# EAGLE design BMFlexFuel V1.2 (EAGLE 8.6.0)
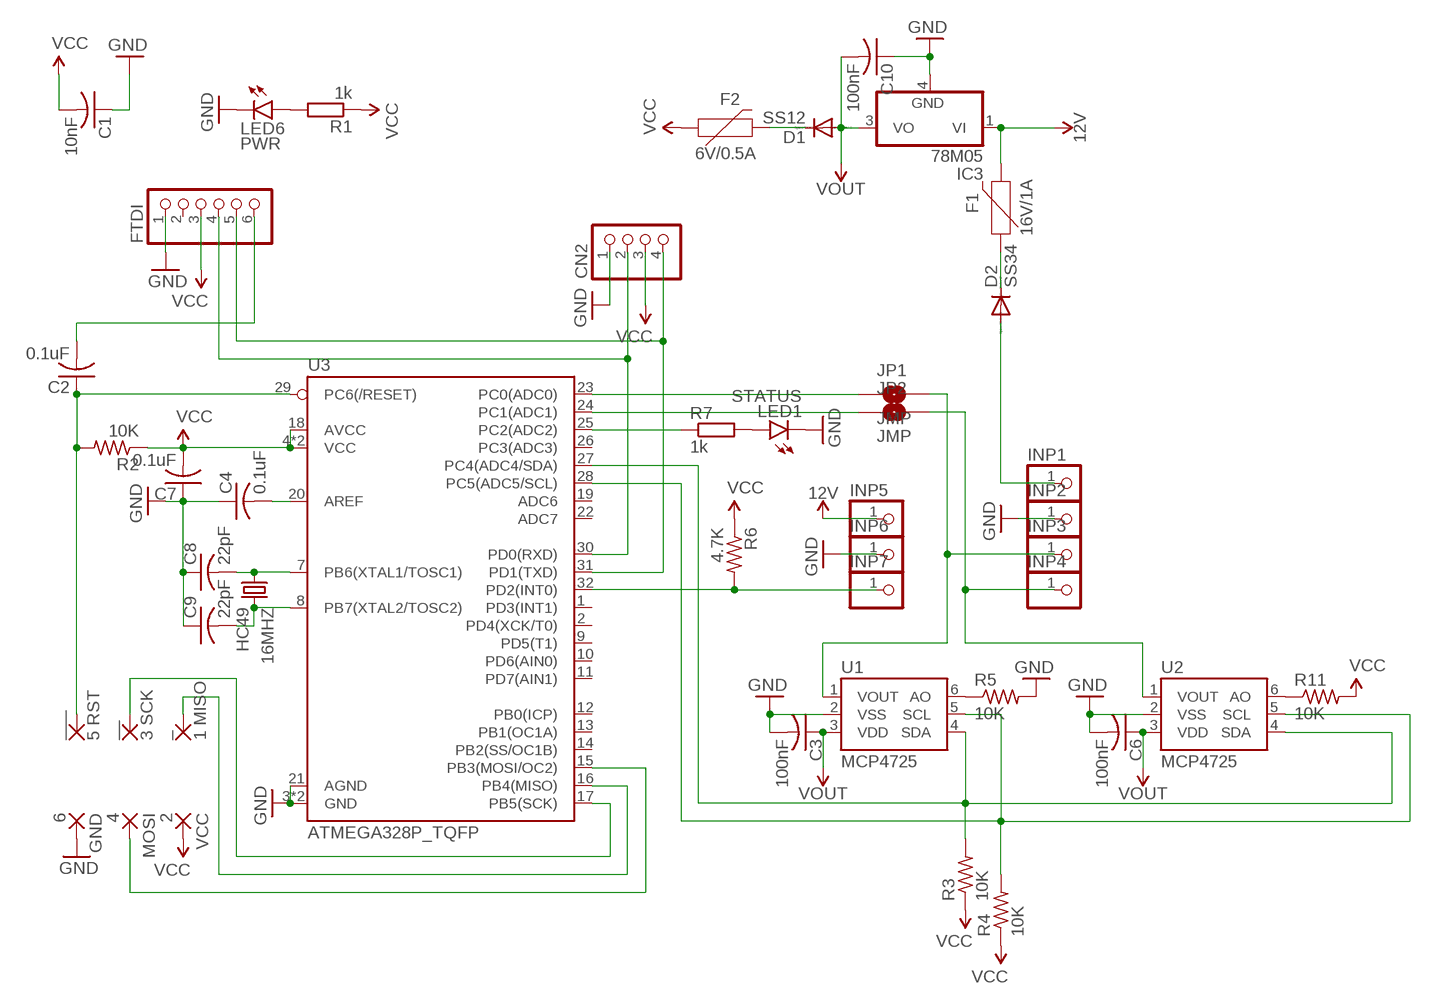
[diagram p0: schematic, sheet 1]

## Parts
16MHZ  HC49  CRYSTALS-NOGND-HC49  [HC49]
_  1 MISO  SMD2  [SMD1,27-2,54]
__  3 SCK  SMD2  [SMD1,27-2,54]
___  5 RST  SMD2  [SMD1,27-2,54]
C1  10nF  C-USC1206  [C1206]
C2  0.1uF  C-USC0603  [C0603]
C3  100nF  C-USC0603  [C0603]
C4  0.1uF  C-USC0603  [C0603]
C6  100nF  C-USC0603  [C0603]
C7  0.1uF  C-USC0603  [C0603]
C8  22pF  C-USC0603  [C0603]
C9  22pF  C-USC0603  [C0603]
C10  100nF  C-USC0603  [C0603]
CN2  PINHD-1X4  [1X04]
D1  SS12  DIODE-DO214AC  [DO214AC]
D2  SS34  DIODE-DO214AC  [DO214AC]
F1  16V/1A  PPTC_HALF-AMP  [1206]
F2  6V/0.5A  PPTC_HALF-AMP  [1206]
FTDI  PINHD-1X6  [1X06]
GND  6  SMD2  [SMD1,27-2,54]
IC3  78M05  MC78M05ABDT  [DPACK_3]
INP1  PINHD-1X1_LARGE  [1X01_LARGE]
INP2  PINHD-1X1_LARGE  [1X01_LARGE]
INP3  PINHD-1X1_LARGE  [1X01_LARGE]
INP4  PINHD-1X1_LARGE  [1X01_LARGE]
INP5  PINHD-1X1_LARGE  [1X01_LARGE]
INP6  PINHD-1X1_LARGE  [1X01_LARGE]
INP7  PINHD-1X1_LARGE  [1X01_LARGE]
JP1  JMP  JUMPER-SMT_2_NO_NO-SILK  [SMT-JUMPER_2_NO_NO-SILK]
JP2  JMP  JUMPER-SMT_2_NO_NO-SILK  [SMT-JUMPER_2_NO_NO-SILK]
LED1  STATUS  LEDCHIPLED_0805  [CHIPLED_0805]
LED6  PWR  LEDCHIPLED_0805  [CHIPLED_0805]
MOSI  4  SMD2  [SMD1,27-2,54]
R1  1k  R-EU_R0603  [R0603]
R2  10K  R-US_R0603  [R0603@1]
R3  10K  R-US_R0603  [R0603@1]
R4  10K  R-US_R0603  [R0603@1]
R5  10K  R-US_R0603  [R0603@1]
R6  4.7K  R-US_R0603  [R0603@1]
R7  1k  R-EU_R0603  [R0603]
R11  10K  R-US_R0603  [R0603@1]
U1  MCP4725  MCP4725SOT-23  [SOT23-6]
U2  MCP4725  MCP4725SOT-23  [SOT23-6]
U3  ATMEGA328P_TQFP  [TQFP32-08]
VCC  2  SMD2  [SMD1,27-2,54]

## Nets
12V: F1.2 IC3.1(VI) INP5.1
GND: C1.1 C3.2 C4.1 C6.2 C7.1 C8.1 C9.1 C10.1 CN2.1 FTDI.1 GND.1(P) IC3.4(GND) INP2.1 INP6.1 LED1.C LED6.C R5.2 U1.2(VSS) U2.2(VSS) U3.3(GND) U3.5(GND) U3.21(AGND)
N$1: INP7.1 R6.2 U3.32(PD2(INT0))
N$2: D2.C F1.1
N$3: JP1.1 U3.23(PC0(ADC0))
N$4: R3.2 U1.4(SDA) U2.4(SDA) U3.27(PC4(ADC4/SDA))
N$5: LED6.A R1.2
N$6: D1.C F2.2
N$7: JP2.1 U3.24(PC1(ADC1))
N$8: LED1.A R7.2
N$9: R7.1 U3.25(PC2(ADC2))
N$10: R5.1 U1.6(AO)
N$11: R11.1 U2.6(AO)
N$13: ___.1(P) C2.1 R2.2 U3.29(PC6(/RESET))
N$15: D2.A INP1.1
N$17: C4.2 U3.20(AREF)
N$18: 16MHZ.1 C8.2 U3.7(PB6(XTAL1/TOSC1))
N$19: INP3.1 JP1.2 U1.1(VOUT)
N$20: C2.2 FTDI.6
N$21: INP4.1 JP2.2 U2.1(VOUT)
N$22: R4.2 U1.5(SCL) U2.5(SCL) U3.28(PC5(ADC5/SCL))
N$23: 16MHZ.2 C9.2 U3.8(PB7(XTAL2/TOSC2))
N$27: CN2.2 FTDI.4 U3.30(PD0(RXD))
N$28: CN2.4 FTDI.5 U3.31(PD1(TXD))
N$30: __.1(P) U3.17(PB5(SCK))
N$31: _.1(P) U3.16(PB4(MISO))
N$33: MOSI.1(P) U3.15(PB3(MOSI/OC2))
VCC: C1.2 C7.2 CN2.3 F2.1 FTDI.3 R1.1 R2.1 R3.1 R4.1 R6.1 R11.2 U3.4(VCC) U3.6(VCC) U3.18(AVCC) VCC.1(P)
VOUT: C3.1 C6.1 C10.2 D1.A IC3.3(VO) U1.3(VDD) U2.3(VDD)
Unconnected: FTDI.2 U3.1(PD3(INT1)) U3.2(PD4(XCK/T0)) U3.9(PD5(T1)) U3.10(PD6(AIN0)) U3.11(PD7(AIN1)) U3.12(PB0(ICP)) U3.13(PB1(OC1A)) U3.14(PB2(SS/OC1B)) U3.19(ADC6) U3.22(ADC7) U3.26(PC3(ADC3))

## Library data of the parts
16MHZ = IQD-Frequency-Products:CRYSTALS-NOGND: CRYSTALS CAN NOT GROUNDED
_ __ ___ GND MOSI VCC = wirepad:SMD2: SMD PAD
C1-C4 C6-C10 = resistor:C-US: CAPACITOR, American symbol
CN2 = pinhead_MOD:PINHD-1X4: PIN HEADER
D1 D2 = diode:DIODE-: DIODE
F1 = SparkFun-Fuses:PPTC: Resettable Fuse PPTC Resettable Fuse. Really a sort of resistor with a polymeric positive temperature coefficient whose resistance increases dramatically with an increase in temperature. When heated by the power passing through the resistance rises causing the current to be limited, protecting the circuit. This is achieved by the transition of the polymer from a crystalline to an amorphous state where the conductive carbon separates breaking the conductive pathways found in the cool crystalline structure. When a PPTC cools back down it resumes conducting letting the circuit turn back on. SparkFun Products: SparkFun RedBoard - Programmed with Arduino <https://www.sparkfun.com/products/12757> Pro Micro - 5V/16MHz <https://www.sparkfun.com/products/12640> Arduino Pro 328 - 5V/16MHz <https://www.sparkfun.com/products/10915> MP3 Trigger <https://www.sparkfun.com/products/13720>; PROD_ID: RES-08585; VALUE: 6V/0.5A
F2 = SparkFun-Fuses:PPTC: Resettable Fuse PPTC Resettable Fuse. Really a sort of resistor with a polymeric positive temperature coefficient whose resistance increases dramatically with an increase in temperature. When heated by the power passing through the resistance rises causing the current to be limited, protecting the circuit. This is achieved by the transition of the polymer from a crystalline to an amorphous state where the conductive carbon separates breaking the conductive pathways found in the cool crystalline structure. When a PPTC cools back down it resumes conducting letting the circuit turn back on. SparkFun Products: SparkFun RedBoard - Programmed with Arduino <https://www.sparkfun.com/products/12757> Pro Micro - 5V/16MHz <https://www.sparkfun.com/products/12640> Arduino Pro 328 - 5V/16MHz <https://www.sparkfun.com/products/10915> MP3 Trigger <https://www.sparkfun.com/products/13720>; PROD_ID: RES-08585
FTDI = pinhead_MOD:PINHD-1X6: PIN HEADER
IC3 = linear:MC78M: 500 mA Positive Voltage Regulators Source: Data sheet <http://www.onsemi.com/pub_link/Collateral/MC78M00-D.PDF>
INP1-INP7 = pinhead_MOD:PINHD-1X1_LARGE: PIN HEADER
JP1 JP2 = SparkFun-Jumpers:JUMPER-SMT_2_NO: Normally open jumper This jumper has two pads in close proximity to each other. Apply solder to close the connection. Round pads are easier to solder for beginners, but are a lot larger. SparkFun Product that uses the round pads: SparkFun EL Sequencer <https://www.sparkfun.com/products/12781>
LED1 LED6 = led:LED: LED OSRAM: - CHIPLED LG R971, LG N971, LY N971, LG Q971, LY Q971, LO R971, LY R971 LH N974, LH R974 LS Q976, LO Q976, LY Q976 LO Q996 - Hyper CHIPLED LW Q18S LB Q993, LB Q99A, LB R99A - SideLED LS A670, LO A670, LY A670, LG A670, LP A670 LB A673, LV A673, LT A673, LW A673 LH A674 LY A675 LS A676, LA A676, LO A676, LY A676, LW A676 LS A679, LY A679, LG A679 - Hyper Micro SIDELED® LS Y876, LA Y876, LO Y876, LY Y876 LT Y87S - SmartLED LW L88C, LW L88S LB L89C, LB L89S, LG L890 LS L89K, LO L89K, LY L89K LS L896, LA L896, LO L896, LY L896 - TOPLED LS T670, LO T670, LY T670, LG T670, LP T670 LSG T670, LSP T670, LSY T670, LOP T670, LYG T670 LG T671, LOG T671, LSG T671 LB T673, LV T673, LT T673, LW T673 LH T674 LS T676, LA T676, LO T676, LY T676, LB T676, LH T676, LSB T676, LW T676 LB T67C, LV T67C, LT T67C, LS T67K, LO T67K, LY T67K, LW E67C LS E67B, LA E67B, LO E67B, LY E67B, LB E67C, LV E67C, LT E67C LW T67C LS T679, LY T679, LG T679 LS T770, LO T770, LY T770, LG T770, LP T770 LB T773, LV T773, LT T773, LW T773 LH T774 LS E675, LA E675, LY E675, LS T675 LS T776, LA T776, LO T776, LY T776, LB T776 LHGB T686 LT T68C, LB T68C - Hyper Mini TOPLED® LB M676 - Mini TOPLED Santana® LG M470 LS M47K, LO M47K, LY M47K Source: http://www.osram.convergy.de LUXEON: - LUMILED® LXK2-PW12-R00, LXK2-PW12-S00, LXK2-PW14-U00, LXK2-PW14-V00 LXK2-PM12-R00, LXK2-PM12-S00, LXK2-PM14-U00 LXK2-PE12-Q00, LXK2-PE12-R00, LXK2-PE12-S00, LXK2-PE14-T00, LXK2-PE14-U00 LXK2-PB12-K00, LXK2-PB12-L00, LXK2-PB12-M00, LXK2-PB14-N00, LXK2-PB14-P00, LXK2-PB14-Q00 LXK2-PR12-L00, LXK2-PR12-M00, LXK2-PR14-Q00, LXK2-PR14-R00 LXK2-PD12-Q00, LXK2-PD12-R00, LXK2-PD12-S00 LXK2-PH12-R00, LXK2-PH12-S00 LXK2-PL12-P00, LXK2-PL12-Q00, LXK2-PL12-R00 Source: www.luxeon.com KINGBRIGHT: KA-3528ASYC Source: www.kingbright.com
R1 R7 = resistor:R-EU_: RESISTOR, European symbol
R2-R6 R11 = resistor:R-US_: RESISTOR, American symbol
U1 U2 = SparkFun-IC-Conversion:MCP4725: MCP4725 DAC Microchip 12-bit I2C DAC, SOT23-6 Datasheet <https://cdn.sparkfun.com/datasheets/BreakoutBoards/MCP4725_2009.pdf> SparkFun Products SparkFun I2C DAC Breakout - MCP4725 <https://www.sparkfun.com/products/12918> (BOB-12918); PROD_ID: IC-08886
U3 = SparkFun-IC-Microcontroller:ATMEGA328P_TQFP: Popular 328P in QFP Storefront component: ATmega328 - TQFP <https://www.sparkfun.com/products/13448> (COM-13448) Datasheet <http://www.sparkfun.com/datasheets/Components/SMD/ATMega328.pdf> SparkFun Products SparkFun RedBoard - Programmed with Arduino <https://www.sparkfun.com/products/12757> (DEV-12757) Arduino Pro Mini 328 - 5V/16MHz <https://www.sparkfun.com/products/11113> (DEV-11113) Arduino Pro Mini 328 - 3.3V/8MHz <https://www.sparkfun.com/products/11114> (DEV-11114) SparkFun OpenLog <https://www.sparkfun.com/products/13712> (DEV-13712) SparkFun MicroView - OLED Arduino Module <https://www.sparkfun.com/products/12923> (DEV-12923) SparkFun Digital Sandbox <https://www.sparkfun.com/products/12651> (DEV-12651) SparkFun PicoBoard <https://www.sparkfun.com/products/11888> (WIG-11888) Arduino Fio <https://www.sparkfun.com/products/10116> (DEV-10116) LilyPad Arduino 328 Main Board <https://www.sparkfun.com/products/13342> (DEV-13342) SparkFun RedStick <https://www.sparkfun.com/products/13741> (DEV-13741) LilyPad MP3 <https://www.sparkfun.com/products/11013> (DEV-11013) LilyPad Arduino SimpleSnap <https://www.sparkfun.com/products/10941> (DEV-10941) SparkFun Stepoko <https://www.sparkfun.com/products/13899> (ROB-13899) SparkFun Geiger Counter <https://www.sparkfun.com/products/11345> (SEN-11345) SparkFun EL Sequencer <https://www.sparkfun.com/products/12781> (COM-12781) Arduino Pro 328 - 5V/16MHz <https://www.sparkfun.com/products/10915> (DEV-10915) CryptoCape <https://www.sparkfun.com/products/12773> (DEV-12773) SparkFun IR Thermometer Evaluation Board - MLX90614 <https://www.sparkfun.com/products/10740> (SEN-10740) SparkFun RedBot Mainboard <https://www.sparkfun.com/products/12097> (ROB-12097) Arduino Pro 328 - 3.3V/8MHz <https://www.sparkfun.com/products/10914> (DEV-10914) SparkFun Block for Intel® Edison - Arduino <https://www.sparkfun.com/products/13036> (DEV-13036) SparkFun Simon Says - Surface Mount Soldering Kit <https://www.sparkfun.com/products/10935> (KIT-10935) SparkFun 7-Segment Serial Display - Red <https://www.sparkfun.com/products/11441> (COM-11441) SparkFun 7-Segment Serial Display - White <https://www.sparkfun.com/products/11629> (COM-11629) SparkFun 7-Segment Serial Display - Yellow <https://www.sparkfun.com/products/11443> (COM-11443) SparkFun 7-Segment Serial Display - Kelly Green <https://www.sparkfun.com/products/11440> (COM-11440) SparkFun 7-Segment Serial Display - Blue <https://www.sparkfun.com/products/11442> (COM-11442) SparkFun OpenSegment Serial Display - 20mm (Blue) <https://www.sparkfun.com/products/11647> (COM-11647) SparkFun OpenSegment Serial Display - 20mm (Green) <https://www.sparkfun.com/products/11646> (COM-11646) SparkFun OpenSegment Serial Display - 20mm (White) <https://www.sparkfun.com/products/11648> (COM-11648) SparkFun OpenSegment Serial Display - 20mm (Red) <https://www.sparkfun.com/products/11644> (COM-11644) SparkFun OpenSegment Serial Display - 20mm (Yellow) <https://www.sparkfun.com/products/11645> (COM-11645) SparkFun OpenSegment Shield <https://www.sparkfun.com/products/13190> (DEV-13190); PROD_ID: IC-09069

## Net classes
3 usbvcc: width 0.508 mm, drill 0.61 mm, clearance 0.254 mm

## Board
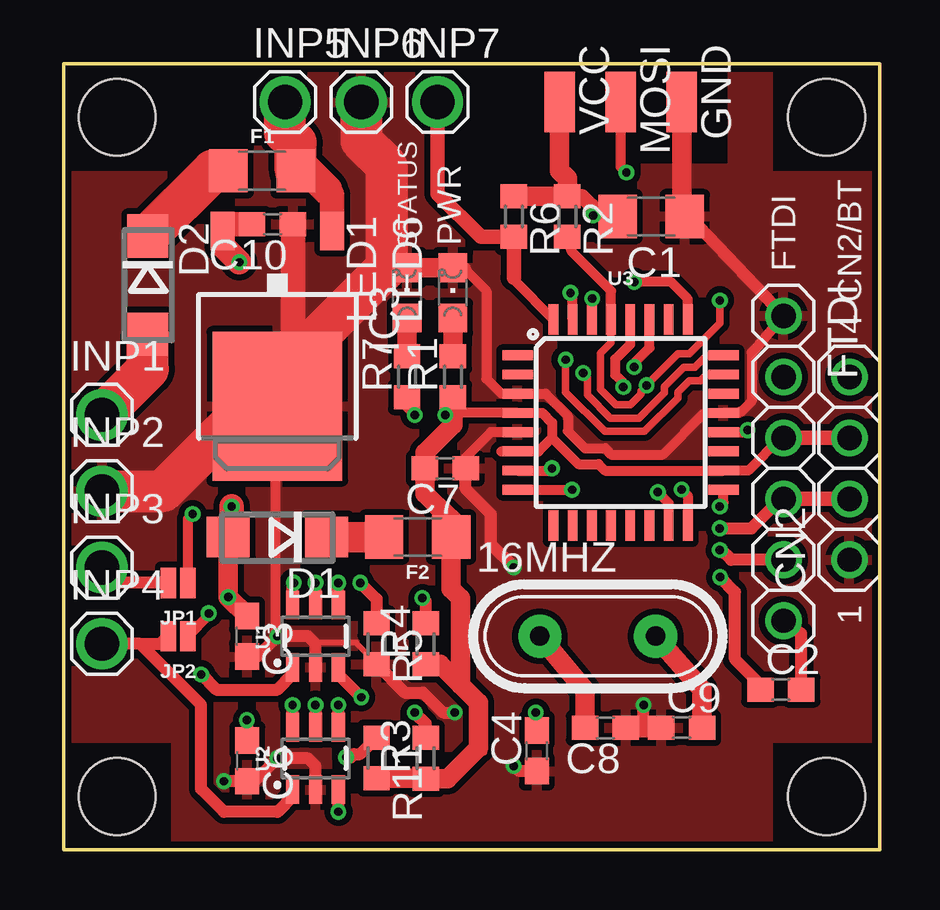
[diagram p1: board, top side]
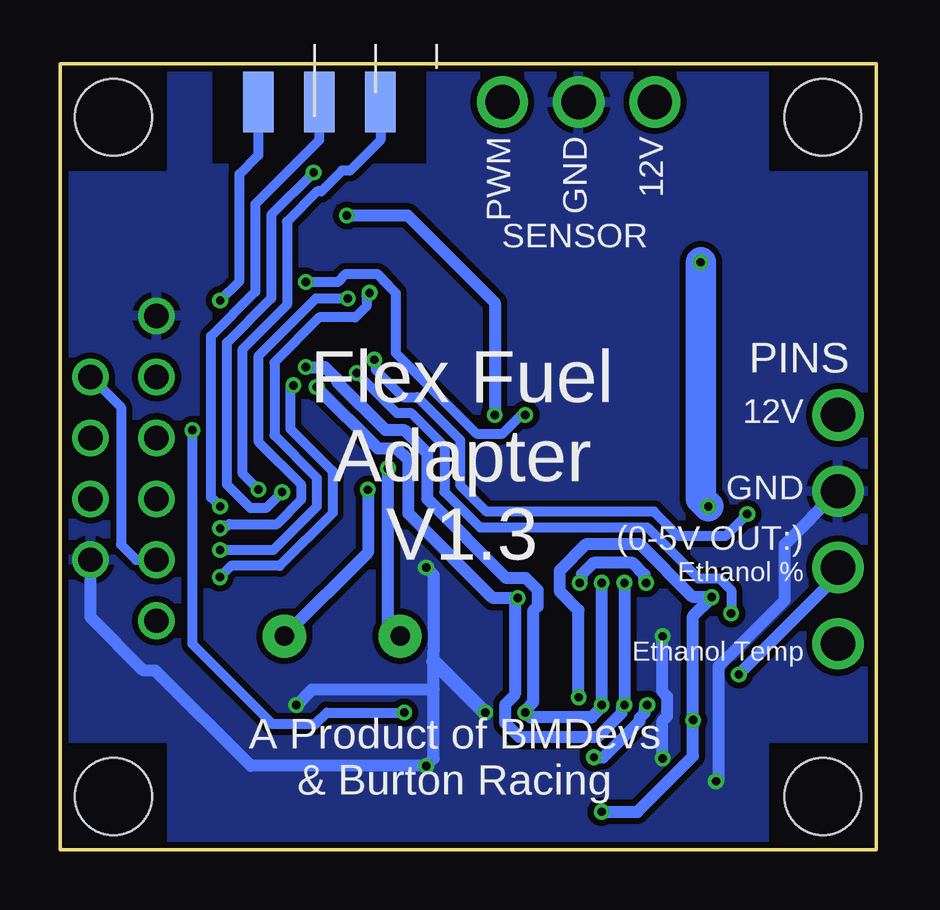
[diagram p2: board, bottom side, seen from below]

Size 34.03 x 32.75 mm. Coordinates in mm from the lower left corner, seen from the top.
Outline: 0,0 0,32.75 34.03,32.75 34.03,0 0,0
Copper layers (1*16): Top 0.035mm / dielectric 1.5mm / Bottom 0.035mm
Design rules "BMBurner_Rules *": minimum track width 10mil, minimum drill 12mil, track to track 10mil, track to pad 10mil, pad to pad 10mil, via to via 10mil, smd to smd 0mil, copper to edge 10mil, drill to drill 10mil, minimum pad ring 10mil, minimum via ring 6mil, stop-mask expansion 2mil, vias tented up to drill 25mil, thermal gap 10mil
Holes 3.2 mm at 2.23,30.53 31.8,30.53 31.8,2.23 2.23,2.23
tRestrict: area 18.8,28.6 to 27.7,32.8; area 0,28.3 to 4.5,32.8; area 29.6,28.3 to 34,32.8; area 29.6,0 to 34,4.5; area 0,0 to 4.5,4.5
bRestrict: area 18.8,28.6 to 27.7,32.8; area 0,28.3 to 4.5,32.8; area 29.6,28.3 to 34,32.8; area 29.6,0 to 34,4.5; area 0,0 to 4.5,4.5

### Footprints (pad centres in the part's own frame; a part is rotated, then mirrored left to right if it is on the bottom)
HC49 = drill 0.813 pad 1.8: 1 -2.413,0; 2 2.413,0
SMD1,27-2,54 = smd 1.27 x 2.54: 1 0,0
C1206 = smd 1.6 x 1.8: 1 -1.4,0; 2 1.4,0
C0603 = smd 1.1 x 1: 1 -0.85,0; 2 0.85,0
1X04 = drill 1.016: 1 -3.81,0; 2 -1.27,0; 3 1.27,0; 4 3.81,0
DO214AC = smd 1.8 x 1.7: A 2.05,0; C -2.05,0
1206 = smd 1.6 x 1.8: 1 -1.4,0; 2 1.4,0
1X06 = drill 1.016: 1 -6.35,0; 2 -3.81,0; 3 -1.27,0; 4 1.27,0; 5 3.81,0; 6 6.35,0
DPACK_3 = smd 1 x 1.6: 1 -2.28,-4.8; 3 2.28,-4.8 | smd 5.4 x 6.2: 4 0,2.5
1X01_LARGE = drill 1.422: 1 0,0
SMT-JUMPER_2_NO_NO-SILK = smd 0.635 x 1.27: 1 -0.406,0; 2 0.406,0
CHIPLED_0805 = smd 1.2 x 1.2: A 0,-1.05; C 0,1.05
R0603 = smd 1 x 1.1: 1 -0.85,0; 2 0.85,0
R0603@1 = smd 1 x 1.1: 1 -0.85,0; 2 0.85,0
SOT23-6 = smd 0.55 x 1.2: 1 0.95,1.3; 2 0,1.3; 3 -0.95,1.3; 4 -0.95,-1.3; 5 0,-1.3; 6 0.95,-1.3
TQFP32-08 = smd 1.27 x 0.406: 1 -4.293,2.8; 2 -4.293,2; 3 -4.293,1.2; 4 -4.293,0.4; 5 -4.293,-0.4; 6 -4.293,-1.2; 7 -4.293,-2; 8 -4.293,-2.8; 17 4.293,-2.8; 18 4.293,-2; 19 4.293,-1.2; 20 4.293,-0.4; 21 4.293,0.4; 22 4.293,1.2; 23 4.293,2; 24 4.293,2.8 | smd 0.406 x 1.27: 9 -2.8,-4.293; 10 -2,-4.293; 11 -1.2,-4.293; 12 -0.4,-4.293; 13 0.4,-4.293; 14 1.2,-4.293; 15 2,-4.293; 16 2.8,-4.293; 25 2.8,4.293; 26 2,4.293; 27 1.2,4.293; 28 0.4,4.293; 29 -0.4,4.293; 30 -1.2,4.293; 31 -2,4.293; 32 -2.8,4.293

### Placement (x,y rotation side)
16MHZ  22.26,8.9 0 top
_  20.67,31.16 180 bottom
__  23.21,31.16 180 bottom
___  25.76,31.16 180 bottom
C1  24.49,26.39 180 top
C2  29.89,6.68 0 top
C3  7.63,8.9 270 top
C4  19.72,4.13 90 top
C6  7.65,3.71 270 top
C7  15.9,15.9 180 top
C8  22.58,5.09 180 top
C9  25.76,5.09 0 top
C10  8.7,26.08 180 top
CN2  32.75,15.9 90 top
D1  8.9,13.04 180 top
D2  3.5,23.53 270 top
F1  8.27,28.3 0 top
F2  14.75,13.04 180 top
FTDI  30,15.9 270 top
GND  25.76,31.16 180 top
IC3  8.9,20.99 180 top
INP1  1.59,18.13 0 top
INP2  1.59,14.95 0 top
INP3  1.59,11.77 0 top
INP4  1.59,8.59 0 top
INP5  9.22,31.16 0 top
INP6  12.4,31.16 0 top
INP7  15.58,31.16 0 top
JP1  4.77,11.13 180 top
JP2  4.77,8.9 180 top
LED1  14.31,23.21 0 top
LED6  16.22,23.21 0 top
MOSI  23.21,31.16 180 top
R1  16.22,19.72 90 top
R2  20.99,26.39 270 top
R3  15.08,3.82 90 top
R4  15.08,8.59 90 top
R5  13.04,8.59 270 top
R6  18.76,26.39 270 top
R7  14.31,19.72 90 top
R11  13.04,3.83 270 top
U1  10.49,8.9 180 top
U2  10.49,3.82 180 top
U3  23.21,17.81 0 top
VCC  20.67,31.16 180 top

### Tracks (layer width: path | path; a pad name or v marks a point on that pad's centre or on a via)
12V
  Top 1.016: IC3.1 11.18,27.29 10.97,27.51
  Top 1.27: 9.67,29.45 9.22,29.89 | F1.2 10.18,28.3 10.97,27.51
  Top 1.75: F1.2 9.67,29.45 | 9.22,29.89 INP5.1
GND  (via drill 0.35)
  Top 0.254: 10.49,8.59 10.67,8.64 12.19,8.64 12.95,7.87 R5.2 | 9.1,15.7 10.16,16.76 IC3.4
  Top 0.406: U3.5 17.81,17.41 16.75,16.35 C7.1 | LED6.C 16.76,24.26 16.76,24.15 17.61,23.3 17.61,19.63 18.24,19.01 U3.3 20.09,19.01 21.01,18.08 21.01,17.45 21.72,16.74 22.57,16.74 22.84,16.47 24.97,16.47 26.71,18.21 U3.21 28.12,18.21 28.18,18.27 28.26,18.27 28.68,18.7 28.68,20.72 FTDI.1 | 9.1,15.7 8.8,15.4 8.8,9.01 v8.9,8.9
  Top 0.508: U1.2 10.49,8.59 10.18,8.9 v8.9,8.9 8.05,8.05 C3.2 | U2.2 10.49,3.5 10.18,3.82 v8.9,3.82 7.95,2.86 C6.2 v6.68,2.86 | R5.2 14.21,6.56 14.97,6.56 15.81,5.72 v16.3,5.72 | C7.1 16.75,15.05 17.81,13.99 17.81,12.72 v18.76,11.77 | C4.1 18.98,3.28 v18.76,3.5 | 24.17,5.09 v24.17,6.04 | FTDI.1 26.07,26.39 C1.1 25.76,26.52 25.76,27.35
  Top 0.813: C8.1 24.17,5.09 C9.1 | LED6.C LED1.C 13.45,24.26 | 25.76,27.35 GND.1 | IC3.4 8.9,19.72 9.22,20.03
  Top 1.016: 10.32,17.07 IC3.4 | C10.1 9.55,20.36 9.22,20.03
  Top 1.27: 8.31,19.08 IC3.4 7.68,18.49
  Top 1.75: 9.22,20.03 13.45,24.26 13.45,28.52 12.4,29.57 INP6.1 | INP2.1 4.13,14.95 7.68,18.49
  Bottom 0.508: v8.9,3.82 8.9,5.37 8.71,5.57 8.71,6.39 8.9,6.59 v8.9,8.9 | 18.44,6.68 18.44,3.82 v18.76,3.5 26.08,3.5 30.05,7.47 30.53,7.47 32.75,9.7 CN2.1 | 18.44,6.68 18.44,7.87 18.44,8.32 18.44,11.45 v18.76,11.77 | 18.44,6.68 23.53,6.68 v24.17,6.04 | v6.68,2.86 6.56,2.98 6.56,7.66 3.82,10.4 3.82,12.72 INP2.1
  Bottom 0.61: v16.3,5.72 18.44,7.87
  pour Bottom: 0,32.75 34.03,32.75 34.03,-0.32 0,-0.32
  pour Top: 0,0 0,32.75 34.03,32.75 34.03,0
N$1
  Top 0.406: U3.32 18.76,23.75 18.76,23.85
  Top 0.61: 18.76,23.85 R6.2 17.39,25.54 15.58,27.35 INP7.1
N$2
  Top 1.27: 6.22,28.3 F1.1
  Top 1.75: D2.C 6.22,28.3
N$3  (via drill 0.35)
  Top 0.305: U3.23 26.8,19.81 26.54,19.55 26.08,19.55 | 26.08,19.55 26.07,19.55 | v20.92,20.42 20.92,20.18 20.91,20.17 20.91,19.08 22.56,17.43 24.2,17.43 25.59,18.82 25.59,19.07 26.08,19.55
  Top 0.406: JP1.1 5.18,13.8 v5.37,13.99
  Bottom 0.406: v20.92,20.42 20.92,20.25 20.86,20.19 20.86,20.02 19.71,18.87 19.12,18.87 17.34,17.09 17.34,15.2 16.24,14.1 9.26,14.1 8.24,13.07 6.29,13.07 v5.37,13.99
N$4  (via drill 0.35)
  Top 0.406: U3.27 24.41,20.92 23.78,20.28 v23.78,20.12
  Top 0.508: U1.4 v11.44,11.13 v11.45,11.13 | v11.45,6.04 v11.44,6.04 U2.4 | v14.63,5.72 15.08,5.27 R3.2
  Bottom 0.508: v11.45,11.13 v11.45,6.04 11.45,5.94 11.86,5.53 14.43,5.53 v14.63,5.72 14.63,5.83 14.3,6.16 14.3,9.96 14.11,10.15 14.11,10.84 14.6,11.33 15.41,11.33 18.71,14.63 18.71,16.52 19.69,17.5 20.46,17.5 22.49,19.53 22.49,19.63 22.98,20.12 v23.78,20.12
N$5
  Top 0.813: R1.2 LED6.A
N$6
  Top 1.27: D1.C F2.2
N$7  (via drill 0.35)
  Top 0.305: U3.24 26.8,20.61 26.31,20.11 25.84,20.11 25.03,19.3 25.03,19.05 23.97,17.99 22.79,17.99 21.82,18.96 21.82,19.69 v21.65,19.87
  Top 0.406: v6.04,9.86 6.04,9.77 JP2.1
  Bottom 0.406: v21.65,19.87 19.99,18.21 19.4,18.21 18,16.81 18,14.92 16.52,13.44 9.54,13.44 7.42,11.32 6.53,11.32 6.04,10.83 v6.04,9.86
N$8
  Top 0.813: R7.2 LED1.A
N$9  (via drill 0.35)
  Top 0.406: U3.25 26.01,22.96 25.3,23.67 v23.78,23.67 | v14.63,18.13 14.31,18.44 R7.1
  Bottom 0.406: v23.78,23.67 22.44,23.67 22.11,24 20.8,24 20.34,23.54 20.34,23.52 20.03,23.21 20.03,20.71 16.66,17.34 15.57,17.34 14.79,18.13 v14.63,18.13
N$10  (via drill 0.35)
  Top 0.508: U1.6 9.54,11.09 v9.59,11.13 | v12.36,11.13 13.04,10.45 R5.1
  Bottom 0.508: v9.59,11.13 9.66,11.2 9.66,11.48 10.15,11.96 11.79,11.96 12.28,11.48 12.28,11.2 v12.36,11.13
N$11  (via drill 0.35)
  Top 0.508: U2.6 v9.54,6.04 | R11.1 12.35,3.99 12.08,3.99 11.96,3.86 v11.77,3.86
  Bottom 0.508: v9.54,6.04 9.66,5.92 9.66,5.7 9.85,5.5 9.85,5.38 11.37,3.86 v11.77,3.86
N$13  (via drill 0.35)
  Top 0.305: U3.29 22.81,21.13 22.38,20.7 22.38,19.19 23.02,18.55 23.63,18.55 24.06,18.98 24.06,19.12 v24.3,19.36 25.61,20.67 26.08,20.67 27.35,21.94 v27.35,22.9
  Top 0.406: U3.29 22.81,23.3 21.2,24.91 R2.2
  Top 0.508: v27.36,11.37 27.98,10.75 27.98,7.95 29.04,6.89 C2.1
  Bottom 0.406: ___.1 25.76,28.94 26.54,28.15 26.54,23.7 v27.35,22.9 | v27.36,11.37 26.9,11.83 24.86,11.83 22.66,14.04 22.66,15.78 24.42,17.54 24.42,19.23 v24.3,19.36
N$15
  Top 1.75: INP1.1 3.5,20.03 D2.A
N$17  (via drill 0.35)
  Top 0.406: U3.20 28.43,17.41 v28.51,17.49
  Top 0.508: v19.68,5.72 C4.2
  Bottom 0.406: v19.68,5.72 22.9,5.72 23.37,5.25 25.18,5.25 28.51,8.59 v28.51,17.49
N$18  (via drill 0.35)
  Top 0.406: U3.7 20.26,15.81 v20.35,15.9
  Top 0.813: C8.2 21.73,6.65 16MHZ.1
  Bottom 0.508: 16MHZ.1 20.35,9.41 v20.35,15.9
N$19  (via drill 0.35)
  Top 0.508: U1.1 9.54,7.32 8.9,6.68 6.36,6.68 v5.72,7.31 | JP1.2 2.23,11.13 INP3.1
  Bottom 0.508: v5.72,7.31 1.59,11.45 INP3.1
N$20
  Top 0.508: C2.2 30.74,9.02 FTDI.6
N$21
  Top 0.508: U2.1 9.54,2.23 8.9,1.59 6.68,1.59 5.72,2.54 5.72,6.04 3.18,8.59 | 3.18,8.59 INP4.1 | 3.18,8.59 4.03,8.59 | 4.03,8.59 JP2.2 | JP2.2 4.05,8.59 4.03,8.59
N$22  (via drill 0.35)
  Top 0.406: U3.28 23.61,21.07 22.99,20.45 22.99,19.8 23.33,19.46 v23.33,19.29
  Top 0.508: U1.5 v10.49,11.13 | v10.49,6.04 U2.5 | v14.95,10.49 15.08,10.36 R4.2
  Bottom 0.254: v14.95,10.49 14.99,10.41 15.06,10.38
  Bottom 0.508: v10.49,11.13 v10.49,6.04 10.61,5.92 10.61,5.7 11.61,4.7 14.87,4.7 15.46,5.29 15.46,6.07 15.06,6.47 15.06,10.38 | v23.33,19.29 20.77,16.73 20.01,16.73 19.5,16.23 19.5,14.02 15.97,10.49 v14.95,10.49
N$23  (via drill 0.35)
  Top 0.406: U3.8 v21.19,15.01
  Top 0.813: C9.2 26.61,6.71 16MHZ.2
  Bottom 0.508: v21.19,15.01 21.19,12.39 16MHZ.2
N$27  (via drill 0.35)
  Top 0.406: U3.30 22.01,22.96 v22.03,22.97
  Top 0.508: v27.35,13.4 28.67,13.4 29.9,14.63 FTDI.4
  Top 0.61: CN2.2 FTDI.4
  Bottom 0.406: v22.03,22.97 23.36,22.97 25.74,20.59 25.74,17 23.98,15.23 23.98,14.58 24.98,13.58 26.97,13.58 27.02,13.53 27.22,13.53 v27.35,13.4
N$28  (via drill 0.35)
  Top 0.406: U3.31 21.21,23.12 v21.12,23.21
  Top 0.508: FTDI.5 27.82,12.09 27.42,12.49 v27.35,12.49
  Bottom 0.406: v21.12,23.21 21.25,23.09 21.25,22.65 21.7,22.19 23.21,22.19 25.08,20.32 25.08,17.27 23.32,15.51 23.32,14.31 25.14,12.49 v27.35,12.49 | CN2.4 31.48,18.44 31.48,12.72 30.85,12.09 FTDI.5
N$30  (via drill 0.35)
  Top 0.406: v27.35,14.31 27.51,14.47 U3.17
  Bottom 0.406: __.1 23.21,29.57 25.88,26.91 25.88,23.25 27.72,21.41 27.72,18.13 27.72,14.69 v27.35,14.31
N$31  (via drill 0.35)
  Top 0.406: v25.76,15.02 26.01,14.77 U3.16
  Bottom 0.406: _.1 20.67,29.57 21.94,28.3 22.27,28.3 23.13,27.44 23.3,27.44 24.56,26.18 24.56,22.71 26.4,20.86 26.4,15.67 v25.76,15.02
N$33  (via drill 0.35)
  Top 0.406: MOSI.1 23.21,28.46 v23.45,28.22 | v24.77,14.91 25.21,14.46 U3.15
  Bottom 0.406: v24.77,14.91 25.43,14.24 26.08,14.24 27.06,15.22 27.06,21.14 25.22,22.98 25.22,26.46 v23.45,28.22
VCC  (via drill 0.35)
  Top 0.254: 17.53,4.06 17.29,4.25
  Top 0.406: 20.35,17.17 20.35,17.81 19.95,18.21 U3.4 16.22,18.21 15.98,18.21 v15.9,18.13 | 20.35,17.17 19.79,16.61 U3.6 18.24,16.61 | 22.24,26.61 v22.06,26.43 | 20.35,17.17 21.45,16.08 22.3,16.08 22.57,15.81 U3.18 28.54,15.81 29.9,17.17 FTDI.3
  Top 0.508: v15.9,18.13 16.22,18.44 R1.1
  Top 0.61: R2.1 21.6,27.24 22.24,26.61 | CN2.3 FTDI.3
  Top 0.813: R11.2 15.07,2.98 R3.1 16,2.97 17.29,4.25 17.29,6.13 16.54,6.88 | 22.24,26.61 C1.2 | VCC.1 20.67,28.3 20.99,27.98 R2.1 R6.1 | 16.54,6.88 15.68,7.74 R4.1 | 16.54,6.88 16.54,10.49 16.15,10.88 F2.1 16.54,13.42 15.58,14.31 15.05,14.84 C7.2 15.05,16.55 16.22,17.72 16.22,18.21
  Bottom 0.508: v22.06,26.43 19.53,26.43 15.9,22.8 v15.9,18.13
VOUT  (via drill 0.35)
  Top 0.508: U1.3 11.44,7.32 v12.4,6.36 | U2.3 v11.44,1.59 v11.45,1.59 | v7.63,5.41 7.63,4.58 C6.1
  Top 0.813: D1.A v6.85,10.53 C3.1
  Top 1.016: v7.31,24.49 6.62,25.18 IC3.3 6.91,26.08 C10.2 | v7,14.31 7,13.18 D1.A
  Bottom 0.508: v11.45,1.59 9.95,1.59 7.63,3.91 v7.63,5.41 C3.1 v6.85,10.53 7.64,10.53 9.83,12.73 12.11,12.73 13.19,11.64 13.19,10.78 12.4,9.99 v12.4,6.36
  Bottom 1.27: v7,14.31 7.31,14.63 v7.31,24.49

### Text on the board
_tsilk: STATUS | PWR | FTDI | CN2/BT | 4 | 1
_bsilk: 12V | GND | PWM | SENSOR | PINS | 12V | Flex Fuel / Adapter / V1.3 | GND | (0-5V OUT:) | Ethanol % | Ethanol Temp | A Product of BMDevs / & Burton Racing